# Altium schematic sheet ReadMe_License.SchDoc
size E
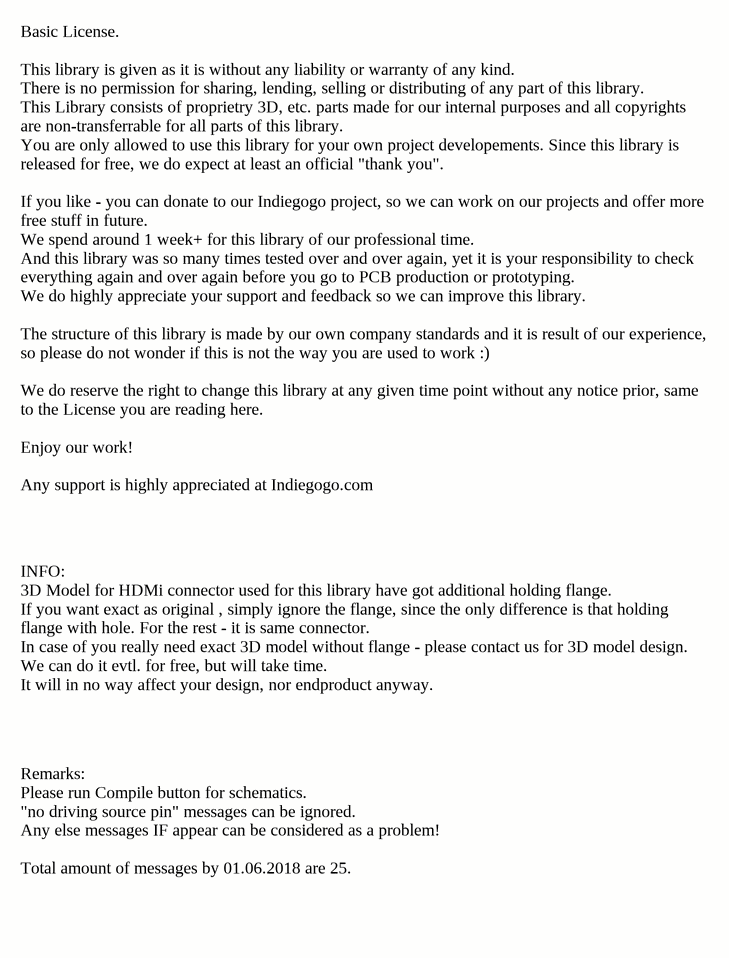
[diagram p0: ReadMe_License.SchDoc]

## Notes on the sheet
- Basic License.
  This library is given as it is without any liability or warranty of any kind.
  There is no permission for sharing, lending, selling or distributing of any part of this library.
  This Library consists of proprietry 3D, etc. parts made for our internal purposes and all copyrights are non-transferrable for all parts of this library.
  You are only allowed to use this library for your own project developements. Since this library is released for free, we do expect at least an official "thank you".
  If you like - you can donate to our Indiegogo project, so we can work on our projects and offer more free stuff in future.
  We spend around 1 week+ for this library of our professional time.
  And this library was so many times tested over and over again, yet it is your responsibility to check everything again and over again before you go to PCB production or prototyping.
  We do highly appreciate your support and feedback so we can improve this library.
  The structure of this library is made by our own company standards and it is result of our experience, so please do not wonder if this is not the way you are used to work :)
  We do reserve the right to change this library at any given time point without any notice prior, same to the License you are reading here.
  Enjoy our work!
  Any support is highly appreciated at Indiegogo.com
- INFO:
  3D Model for HDMi connector used for this library have got additional holding flange.
  If you want exact as original , simply ignore the flange, since the only difference is that holding flange with hole. For the rest - it is same connector.
  In case of you really need exact 3D model without flange - please contact us for 3D model design.
  We can do it evtl. for free, but will take time.
  It will in no way affect your design, nor endproduct anyway.
- Remarks:
  Please run Compile button for schematics.
  "no driving source pin" messages can be ignored.
  Any else messages IF appear can be considered as a problem!
  Total amount of messages by 01.06.2018 are 25.